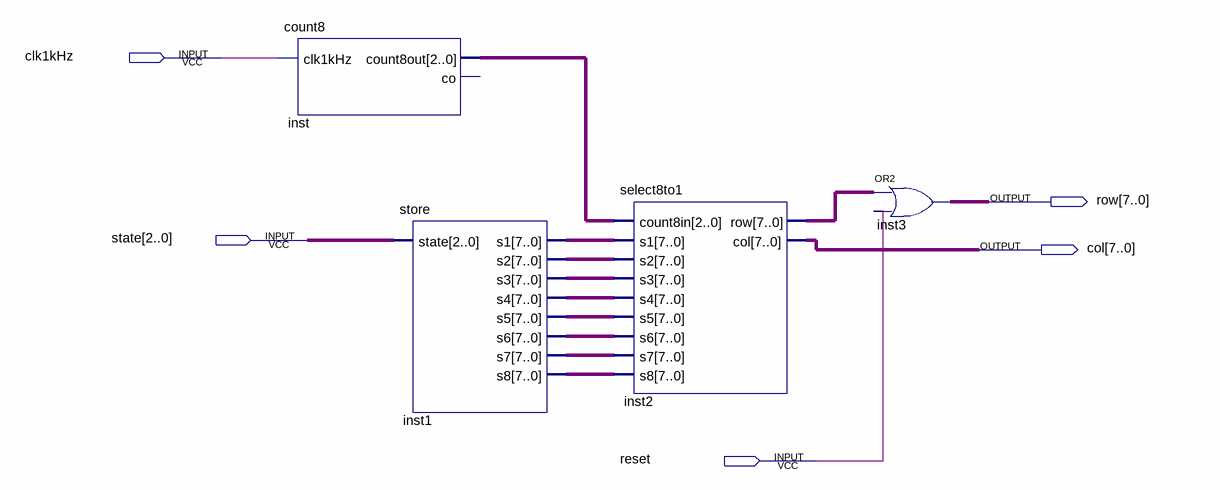
[diagram p0: schematic sheet]
// Quartus schematic dianzhen.bdf as structural Verilog: 4 symbols, 5 pins
module dianzhen (
  input  clk1kHz,
  input  [2:0] state,
  input  reset,
  output [7:0] row,
  output [7:0] col
);

  wire [2:0] inst_count8out;
  wire [7:0] inst1_s1, inst1_s2, inst1_s3, inst1_s4, inst1_s5, inst1_s6, inst1_s7, inst1_s8, inst2_row;

  count8 inst (.clk1kHz(clk1kHz), .count8out(inst_count8out));  // open: co
  store inst1 (
    .state(state), .s1(inst1_s1), .s2(inst1_s2), .s3(inst1_s3), .s4(inst1_s4), .s5(inst1_s5), .s6(inst1_s6),
    .s7(inst1_s7), .s8(inst1_s8));
  select8to1 inst2 (
    .count8in(inst_count8out), .s1(inst1_s1), .s2(inst1_s2), .s3(inst1_s3), .s4(inst1_s4), .s5(inst1_s5),
    .s6(inst1_s6), .s7(inst1_s7), .s8(inst1_s8), .row(inst2_row), .col(col));
  assign row = inst2_row | {8{reset}};  // OR2 inst3, 8 bits wide
endmodule
